# Altium schematic sheet mechanical.SchDoc
size A4
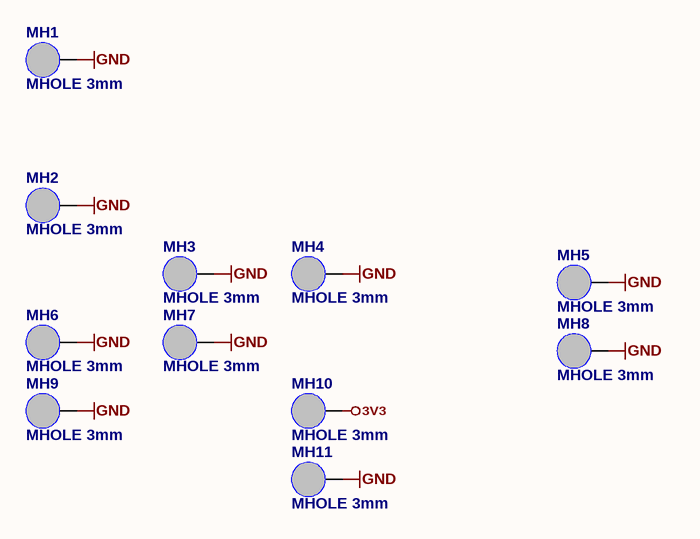
[diagram p0: mechanical.SchDoc]

## Parts
MH1  MHOLE 3mm  [3mm screw drill I]  (no BOM)
MH2  MHOLE 3mm  [3mm screw drill I]  (no BOM)
MH3  MHOLE 3mm  [3mm screw drill I]  (no BOM)
MH4  MHOLE 3mm  [3mm screw drill I]  (no BOM)
MH5  MHOLE 3mm  [3mm screw drill I]  (no BOM)
MH6  MHOLE 3mm  [3mm screw drill I]  (no BOM)
MH7  MHOLE 3mm  [3mm screw drill I]  (no BOM)
MH8  MHOLE 3mm  [3mm screw drill I]  (no BOM)
MH9  MHOLE 3mm  [3mm screw drill I]  (no BOM)
MH10  MHOLE 3mm  [3mm screw drill I]  (no BOM)
MH11  MHOLE 3mm  [3mm screw drill I]  (no BOM)

## Nets
3V3: MH10.1(GND)
GND: MH1.1(GND) MH2.1(GND) MH3.1(GND) MH4.1(GND) MH5.1(GND) MH6.1(GND) MH7.1(GND) MH8.1(GND) MH9.1(GND) MH11.1(GND)

## Library data of the parts
MH1-MH11 = MHOLE_3MM: 3mm Mounting Hole